# EAGLE design secs_q84 v2 (EAGLE 9.7.0)
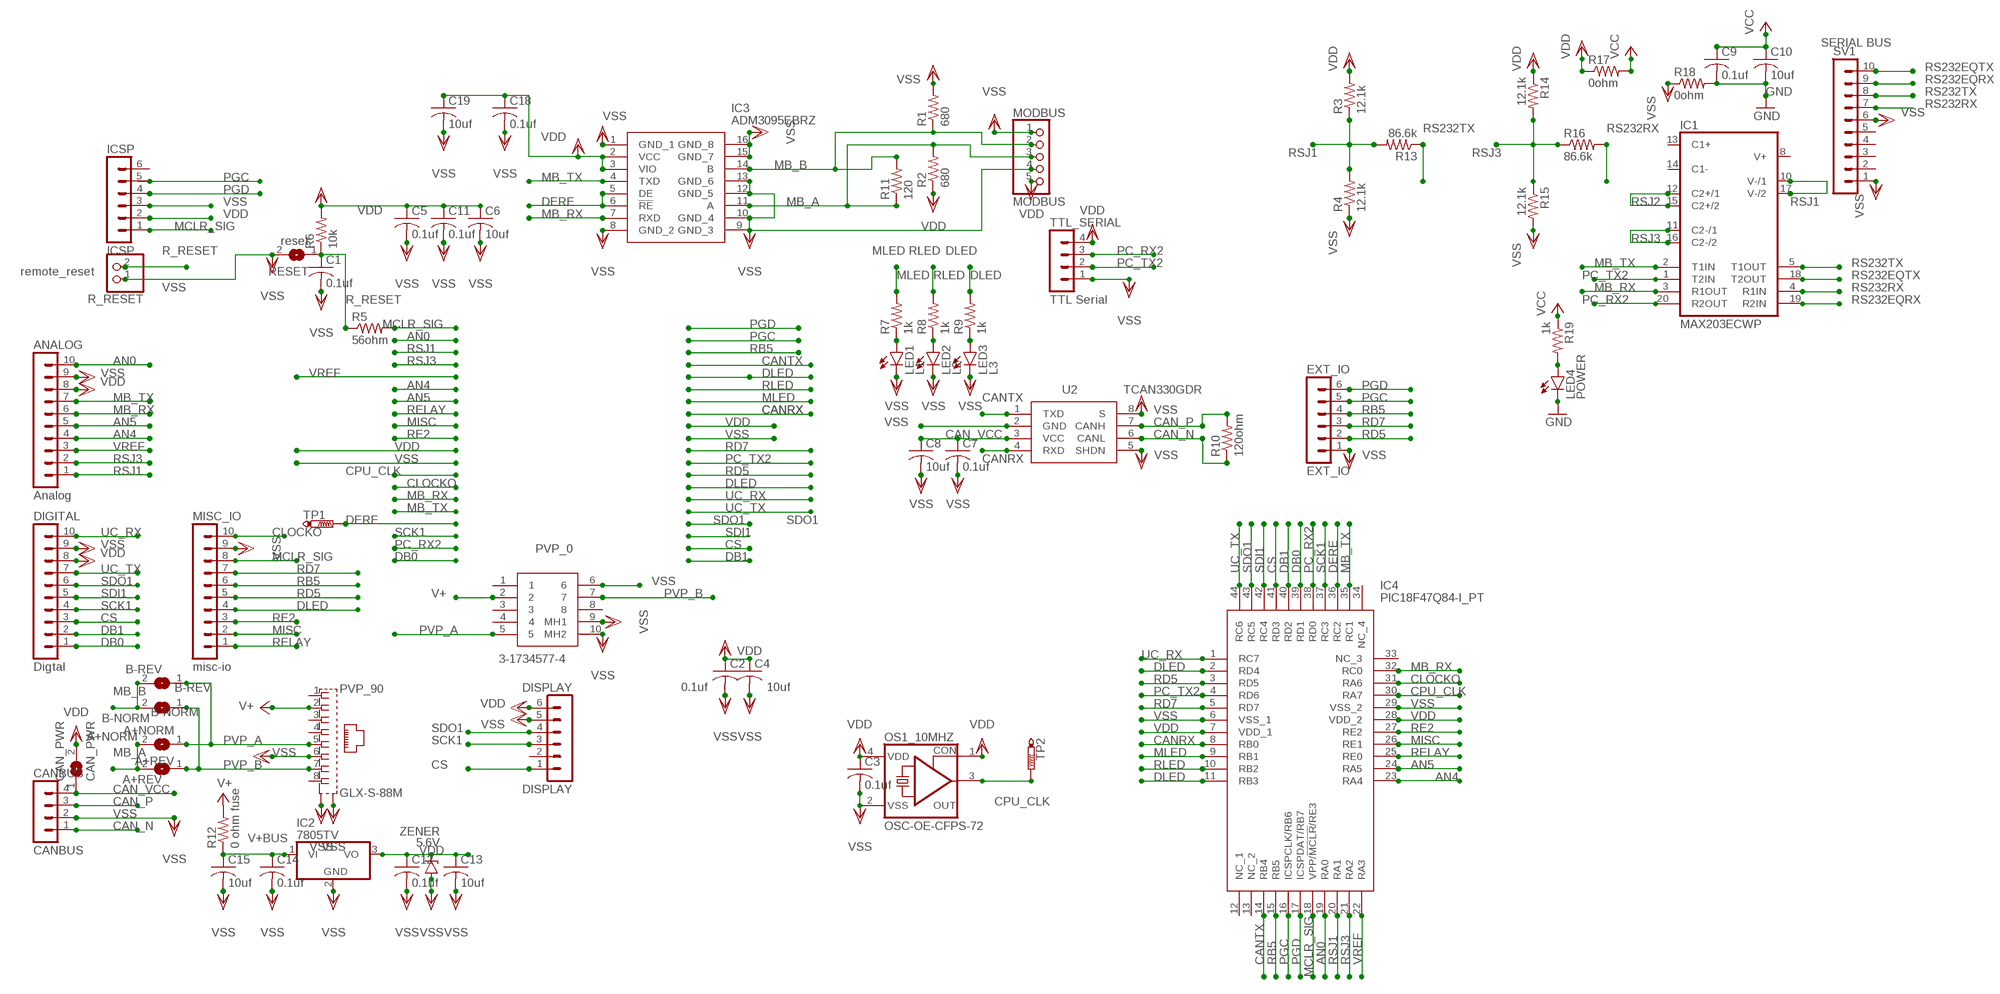
[diagram p0: schematic, sheet 1]

## Parts
A+NORM  A+NORM  SJ  [SJ]
A+REV  A+REV  SJ  [SJ]
ANALOG  Analog  MA10-1  [MA10-1]
B-NORM  B-NORM  SJ  [SJ]
B-REV  B-REV  SJ  [SJ]
C1  0.1uf  C-USC0805  [C0805]
C2  0.1uf  C-USC0805  [C0805]
C3  0.1uf  C-USC0805  [C0805]
C4  10uf  C-USC0805  [C0805]
C5  0.1uf  C-USC0805  [C0805]
C6  10uf  C-USC0805  [C0805]
C7  0.1uf  C-USC0805  [C0805]
C8  10uf  C-USC0805  [C0805]
C9  0.1uf  C-USC0805  [C0805]
C10  10uf  C-USC0805  [C0805]
C11  0.1uf  C-USC0805  [C0805]
C12  0.1uf  C-USC0805  [C0805]
C13  10uf  C-USC0805  [C0805]
C14  0.1uf  C-USC0805  [C0805]
C15  10uf  C-USC0805  [C0805]
C18  0.1uf  C-USC0805  [C0805]
C19  10uf  C-USC0805  [C0805]
CAN_PWR  CAN_PWR  SJ  [SJ]
CANBUS  CANBUS  MA04-1  [MA04-1]
DIGITAL  Digtal  MA10-1  [MA10-1]
DISPLAY  DISPLAY  MA06-1  [MA06-1]
EXT_IO  EXT_IO  MA06-1  [MA06-1]
IC1  MAX203ECWP  [SO20L]
IC2  7805TV  [TO220V]
IC3  ADM3095EBRZ  [SOIC127P600X175-16N]
IC4  PIC18F47Q84-I_PT  [QFP80P1200X1200X120-44N]
ICSP  ICSP  MA06-1  [MA06-1]
LED1  L1  LEDCHIPLED_0805  [CHIPLED_0805]
LED2  L2  LEDCHIPLED_0805  [CHIPLED_0805]
LED3  L3  LEDCHIPLED_0805  [CHIPLED_0805]
LED4  POWER  LEDCHIP-LED0603  [CHIP-LED0603]
MISC_IO  misc-io  MA10-1  [MA10-1]
MODBUS  MODBUS  PINHD-1X5  [1X05]
OS1_10MHZ  OSC-OE-CFPS-72  [7.2X5.2-4-PAD]
PVP_0  3-1734577-4  [317345774]
PVP_90  GLX-S-88M  [GLX-S-88M]
R1  680  R-US_R0805  [R0805]
R2  680  R-US_R0805  [R0805]
R3  12.1k  R-US_R0805  [R0805]
R4  12.1k  R-US_R0805  [R0805]
R5  56ohm  R-US_R0805  [R0805]
R6  10k  R-US_R0805  [R0805]
R7  1k  R-US_R0805  [R0805]
R8  1k  R-US_R0805  [R0805]
R9  1k  R-US_R0805  [R0805]
R10  120ohm  R-US_R0805  [R0805]
R11  120  R-US_R0805  [R0805]
R12  0 ohm fuse  R-US_R1206  [R1206]
R13  86.6k  R-US_R0805  [R0805]
R14  12.1k  R-US_R0805  [R0805]
R15  12.1k  R-US_R0805  [R0805]
R16  86.6k  R-US_R0805  [R0805]
R17  0ohm  R-US_R0805  [R0805]
R18  0ohm  R-US_R0805  [R0805]
R19  1k  R-US_R0805  [R0805]
R_RESET  remote_reset  PINHD-1X2  [1X02]
RESET  reset  SJ  [SJ]
SV1  SERIAL BUS  MA10-1  [MA10-1]
TP1  PTR1PAD1-13  [P1-13]
TP2  PTR1PAD1-13  [P1-13]
TTL_SERIAL  TTL Serial  MA04-1  [MA04-1]
U2  TCAN330GDR  [SOIC127P600X175-8N]
ZENER  5.6V  ZENER-DIODESMB  [SMB]

## Nets
AN0: ANALOG.10 IC4.19(RA0)
AN4: ANALOG.4 IC4.23(RA4)
AN5: ANALOG.5 IC4.24(RA5)
CAN_N: CANBUS.1 R10.1 U2.6(CANL)
CAN_P: CANBUS.3 R10.2 U2.7(CANH)
CAN_VCC [icurrent]: C7.1 C8.1 CAN_PWR.1 CANBUS.4 U2.3(VCC)
CANRX: IC4.8(RB0) U2.4(RXD)
CANTX: IC4.14(RB4) U2.1(TXD)
CLOCKO: IC4.31(RA6) MISC_IO.10
CPU_CLK: IC4.30(RA7) OS1_10MHZ.3(OUT) TP2.TP
CS: DIGITAL.3 DISPLAY.1 IC4.41(RD3)
DB0: DIGITAL.1 IC4.39(RD1)
DB1: DIGITAL.2 IC4.40(RD2)
DERE: IC3.5(DE) IC3.6(!RE) IC4.36(RC2) TP1.TP
DLED: IC4.2(RD4) IC4.11(RB3) MISC_IO.4 R9.2
GND [icurrent]: C9.2 C10.2 LED4.C R18.2
MB_A: A+NORM.2 A+REV.2 IC3.11(A) MODBUS.3 R2.2 R11.1
MB_B: B-NORM.2 B-REV.2 IC3.14(B) MODBUS.2 R1.1 R11.2
MB_RX: ANALOG.6 IC1.3(R1OUT) IC3.7(RXD) IC4.32(RC0)
MB_TX: ANALOG.7 IC1.2(T1IN) IC3.4(TXD) IC4.35(RC1)
MCLR_SIG: IC4.18(VPP/!MCLR!/RE3) ICSP.1 MISC_IO.8 R5.2
MISC: IC4.26(RE1) MISC_IO.2
MLED: IC4.9(RB1) R7.2
N$3: LED4.A R19.2
N$4: LED1.A R7.1
N$5: LED2.A R8.1
N$6: LED3.A R9.1
PC_RX2: IC1.20(R2OUT) IC4.38(RD0) TTL_SERIAL.3
PC_TX2: IC1.1(T2IN) IC4.4(RD6) TTL_SERIAL.2
PGC: EXT_IO.5 IC4.16(ICSPCLK/RB6) ICSP.5
PGD: EXT_IO.6 IC4.17(ICSPDAT/RB7) ICSP.4
PVP_A: A+NORM.1 B-REV.1 PVP_0.5 PVP_90.5
PVP_B: A+REV.1 B-NORM.1 PVP_0.7 PVP_90.7
R_RESET: C1.1 R5.1 R6.1 R_RESET.2 RESET.1
RB5: EXT_IO.4 IC4.15(RB5) MISC_IO.6
RD5: EXT_IO.2 IC4.3(RD5) MISC_IO.5
RD7: EXT_IO.3 IC4.5(RD7) MISC_IO.7
RE2: IC4.27(RE2) MISC_IO.3
RELAY: IC4.25(RE0) MISC_IO.1
RLED: IC4.10(RB2) R8.2
RS232EQRX: IC1.19(R2IN) SV1.9
RS232EQTX: IC1.18(T2OUT) SV1.10
RS232RX: IC1.4(R1IN) R16.2 SV1.7
RS232TX: IC1.5(T1OUT) R13.1 SV1.8
RSJ1: ANALOG.1 IC1.10(V-/1) IC1.17(V-/2) IC4.20(RA1) R3.1 R4.2 R13.2
RSJ2: IC1.12(C2+/1) IC1.15(C2+/2)
RSJ3: ANALOG.2 IC1.11(C2-/1) IC1.16(C2-/2) IC4.21(RA2) R14.2 R15.1 R16.1
SCK1: DIGITAL.4 DISPLAY.3 IC4.37(RC3)
SDI1: DIGITAL.5 IC4.42(RC4)
SDO1: DIGITAL.6 DISPLAY.4 IC4.43(RC5)
UC_RX: DIGITAL.10 IC4.1(RC7)
UC_TX: DIGITAL.7 IC4.44(RC6)
V+ [icurrent]: PVP_0.2 PVP_90.2 R12.2
V+BUS [icurrent]: C14.1 C15.1 IC2.1(VI) R12.1
VCC [icurrent]: C9.1 C10.1 R17.2 R19.1
VDD [icurrent]: ANALOG.8 C2.1 C3.1 C4.1 C5.1 C6.1 C11.1 C12.1 C13.1 C18.1 C19.1 CAN_PWR.2 DIGITAL.8 DISPLAY.6 IC2.3(VO) IC3.2(VCC) IC3.3(VIO) IC4.7(VDD_1) IC4.28(VDD_2) ICSP.2 MODBUS.5 OS1_10MHZ.1(CON) OS1_10MHZ.4(VDD) R2.1 R3.2 R6.2 R14.1 R17.1 TTL_SERIAL.4 ZENER.C
VREF: ANALOG.3 IC4.22(RA3)
VSS [icurrent]: ANALOG.9 C1.2 C2.2 C3.2 C4.2 C5.2 C6.2 C7.2 C8.2 C11.2 C12.2 C13.2 C14.2 C15.2 C18.2 C19.2 CANBUS.2 DIGITAL.9 DISPLAY.5 EXT_IO.1 IC2.2(GND) IC3.1(GND_1) IC3.8(GND_2) IC3.9(GND_3) IC3.10(GND_4) IC3.12(GND_5) IC3.13(GND_6) IC3.15(GND_7) IC3.16(GND_8) IC4.6(VSS_1) IC4.29(VSS_2) ICSP.3 LED1.C LED2.C LED3.C MISC_IO.9 MODBUS.1 MODBUS.4 OS1_10MHZ.2(VSS) PVP_0.6 PVP_0.9(MH1) PVP_0.10(MH2) PVP_90.6 PVP_90.S1 PVP_90.S2 R1.2 R4.1 R15.2 R18.1 R_RESET.1 RESET.2 SV1.1 SV1.6 TTL_SERIAL.1 U2.2(GND) U2.5(SHDN) U2.8(S) ZENER.A
Unconnected: DISPLAY.2 IC1.8(V+) IC1.13(C1+) IC1.14(C1-) IC4.12(NC_1) IC4.13(NC_2) IC4.33(NC_3) IC4.34(NC_4) ICSP.6 PVP_0.1 PVP_0.3 PVP_0.4 PVP_0.8 PVP_90.1 PVP_90.3 PVP_90.4 PVP_90.8 SV1.2 SV1.3 SV1.4 SV1.5

## Power pins joined to a net without a drawn wire
GND: IC1.6(GND) IC1.9(GND)
VCC: IC1.7(VCC)

## Library data of the parts
A+NORM A+REV B-NORM B-REV CAN_PWR RESET = jumper:SJ: SMD solder JUMPER
ANALOG DIGITAL MISC_IO SV1 = con-lstb:MA10-1: PIN HEADER; OC_FARNELL: unknown; OC_NEWARK: unknown
C1-C15 C18 C19 = rcl:C-US: CAPACITOR, American symbol; SPICEPREFIX: C
CANBUS TTL_SERIAL = con-lstb:MA04-1: PIN HEADER; OC_FARNELL: unknown; OC_NEWARK: unknown
DISPLAY EXT_IO ICSP = con-lstb:MA06-1: PIN HEADER; OC_FARNELL: unknown; OC_NEWARK: unknown
IC1 = maxim:MAX203ECWP: RS232 TRANSCEIVER; MPN: MAX203ECWP+G36; OC_FARNELL: 1224204; OC_NEWARK: 89K3435
IC2 = linear:78*: Positive VOLTAGE REGULATOR Source: http://cache.national.com/ds/LM/LM78L05.pdf http://www.fairchildsemi.com/ds/LM/LM7805.pdf
IC3 = ADM3095EBRZ:ADM3095EBRZ: Level 4 EMC Protected RS-485 Transceiver with Full +/-42 V Fault Protection Source: Datasheet <https://componentsearchengine.com/Datasheets/1/ADM3095EBRZ.pdf>; DESCRIPTION: Level 4 EMC Protected RS-485 Transceiver with Full +/-42 V Fault Protection; HEIGHT: 1.75mm; MANUFACTURER_NAME: Analog Devices; MANUFACTURER_PART_NUMBER: ADM3095EBRZ; MOUSER_PART_NUMBER: 584-ADM3095EBRZ; MOUSER_PRICE-STOCK: https://www.mouser.com/Search/Refine.aspx?Keyword=584-ADM3095EBRZ
IC4 = PIC18F47Q84-I_PT:PIC18F47Q84-I_PT: 8-bit Microcontrollers - MCU CAN-FD, 128KB Flash, 13KB RAM, 12b ADC3, UTMR, DAC, Comp, PWM, CCP, CWG, HLT, WWDT, SCAN/CRC, ZCD, PPS,Comms IDLE/DOZE/PMD, JTAG Source: Datasheet <https://ww1.microchip.com/downloads/en/DeviceDoc/PIC18F27-47-57Q84-Data-Sheet-40002213D.pdf>; DESCRIPTION: 8-bit Microcontrollers - MCU CAN-FD, 128KB Flash, 13KB RAM, 12b ADC3, UTMR, DAC, Comp, PWM, CCP, CWG, HLT, WWDT, SCAN/CRC, ZCD, PPS,Comms IDLE/DOZE/PMD, JTAG; HEIGHT: 1.2mm; MANUFACTURER_NAME: Microchip; MANUFACTURER_PART_NUMBER: PIC18F47Q84-I/PT; MOUSER_PART_NUMBER: 579-PIC18F47Q84-I/PT; MOUSER_PRICE-STOCK: https://www.mouser.co.uk/ProductDetail/Microchip-Technology/PIC18F47Q84-I-PT?qs=d0WKAl%252BL4KYthTnAmf%2FYSg%3D%3D
LED1-LED4 = led:LED: LED OSRAM: - CHIPLED LG R971, LG N971, LY N971, LG Q971, LY Q971, LO R971, LY R971 LH N974, LH R974 LS Q976, LO Q976, LY Q976 LO Q996 - Hyper CHIPLED LW Q18S LB Q993, LB Q99A, LB R99A - SideLED LS A670, LO A670, LY A670, LG A670, LP A670 LB A673, LV A673, LT A673, LW A673 LH A674 LY A675 LS A676, LA A676, LO A676, LY A676, LW A676 LS A679, LY A679, LG A679 - Hyper Micro SIDELED® LS Y876, LA Y876, LO Y876, LY Y876 LT Y87S - SmartLED LW L88C, LW L88S LB L89C, LB L89S, LG L890 LS L89K, LO L89K, LY L89K LS L896, LA L896, LO L896, LY L896 - TOPLED LS T670, LO T670, LY T670, LG T670, LP T670 LSG T670, LSP T670, LSY T670, LOP T670, LYG T670 LG T671, LOG T671, LSG T671 LB T673, LV T673, LT T673, LW T673 LH T674 LS T676, LA T676, LO T676, LY T676, LB T676, LH T676, LSB T676, LW T676 LB T67C, LV T67C, LT T67C, LS T67K, LO T67K, LY T67K, LW E67C LS E67B, LA E67B, LO E67B, LY E67B, LB E67C, LV E67C, LT E67C LW T67C LS T679, LY T679, LG T679 LS T770, LO T770, LY T770, LG T770, LP T770 LB T773, LV T773, LT T773, LW T773 LH T774 LS E675, LA E675, LY E675, LS T675 LS T776, LA T776, LO T776, LY T776, LB T776 LHGB T686 LT T68C, LB T68C - Hyper Mini TOPLED® LB M676 - Mini TOPLED Santana® LG M470 LS M47K, LO M47K, LY M47K Source: http://www.osram.convergy.de LUXEON: - LUMILED® LXK2-PW12-R00, LXK2-PW12-S00, LXK2-PW14-U00, LXK2-PW14-V00 LXK2-PM12-R00, LXK2-PM12-S00, LXK2-PM14-U00 LXK2-PE12-Q00, LXK2-PE12-R00, LXK2-PE12-S00, LXK2-PE14-T00, LXK2-PE14-U00 LXK2-PB12-K00, LXK2-PB12-L00, LXK2-PB12-M00, LXK2-PB14-N00, LXK2-PB14-P00, LXK2-PB14-Q00 LXK2-PR12-L00, LXK2-PR12-M00, LXK2-PR14-Q00, LXK2-PR14-R00 LXK2-PD12-Q00, LXK2-PD12-R00, LXK2-PD12-S00 LXK2-PH12-R00, LXK2-PH12-S00 LXK2-PL12-P00, LXK2-PL12-Q00, LXK2-PL12-R00 Source: www.luxeon.com KINGBRIGHT: KA-3528ASYC Source: www.kingbright.com
MODBUS = pinhead:PINHD-1X5: PIN HEADER
OS1_10MHZ = IQD-Frequency-Products:OSC-OE: OSCILLATOR WITH OE
PVP_0 = 3-1734577-4:3-1734577-4: RJ45 Connector, Single Port, 1 x 1, Standard Connector Contact Density, Jack, Shielded, Cat 3, Standard - Latch Down, 8 Position, Standard Profile Source: Datasheet <https://www.te.com/commerce/DocumentDelivery/DDEController?Action=showdoc&DocId=Customer Drawing1734577D1pdfEnglishENG_CD_1734577_D1.pdf3-1734577-4>; DESCRIPTION: RJ45 Connector, Single Port, 1 x 1, Standard Connector Contact Density, Jack, Shielded, Cat 3, Standard - Latch Down, 8 Position, Standard Profile; HEIGHT: 16.8mm; MANUFACTURER_NAME: TE Connectivity; MANUFACTURER_PART_NUMBER: 3-1734577-4; MOUSER_PART_NUMBER: 571-3-1734577-4; MOUSER_PRICE-STOCK: https://www.mouser.co.uk/ProductDetail/TE-Connectivity-AMP/3-1734577-4?qs=Z4JOKa0a9TUSCOA052xCCw%3D%3D
PVP_90 = con-kycon:GLX-S-88M: Mod. Jack, Right Angle, 8 posiotion, 8 contatcs RJ45 Source: GLX-S-88M.pdf; OC_FARNELL: unknown; OC_NEWARK: unknown
R1-R19 = rcl:R-US_: RESISTOR, American symbol; SPICEPREFIX: R
R_RESET = pinhead:PINHD-1X2: PIN HEADER
TP1 TP2 = testpad:PTR1: TEST PIN
U2 = TCAN330GDR:TCAN330GDR: 3.3-V CAN Transceivers with CAN FD (Flexible Data Rate) Source: Datasheet <http://www.ti.com/lit/gpn/TCAN330G>; DESCRIPTION: 3.3-V CAN Transceivers with CAN FD (Flexible Data Rate); HEIGHT: 1.75mm; MANUFACTURER_NAME: Texas Instruments; MANUFACTURER_PART_NUMBER: TCAN330GDR; MOUSER_PART_NUMBER: 595-TCAN330GDR; MOUSER_PRICE-STOCK: https://www.mouser.co.uk/ProductDetail/Texas-Instruments/TCAN330GDR?qs=9DwIlvx97adeWwzxdqwSPw%3D%3D
ZENER = diode:ZENER-DIODE: Z-Diode

## Net classes
1 icurrent: width 0.305 mm

## Board
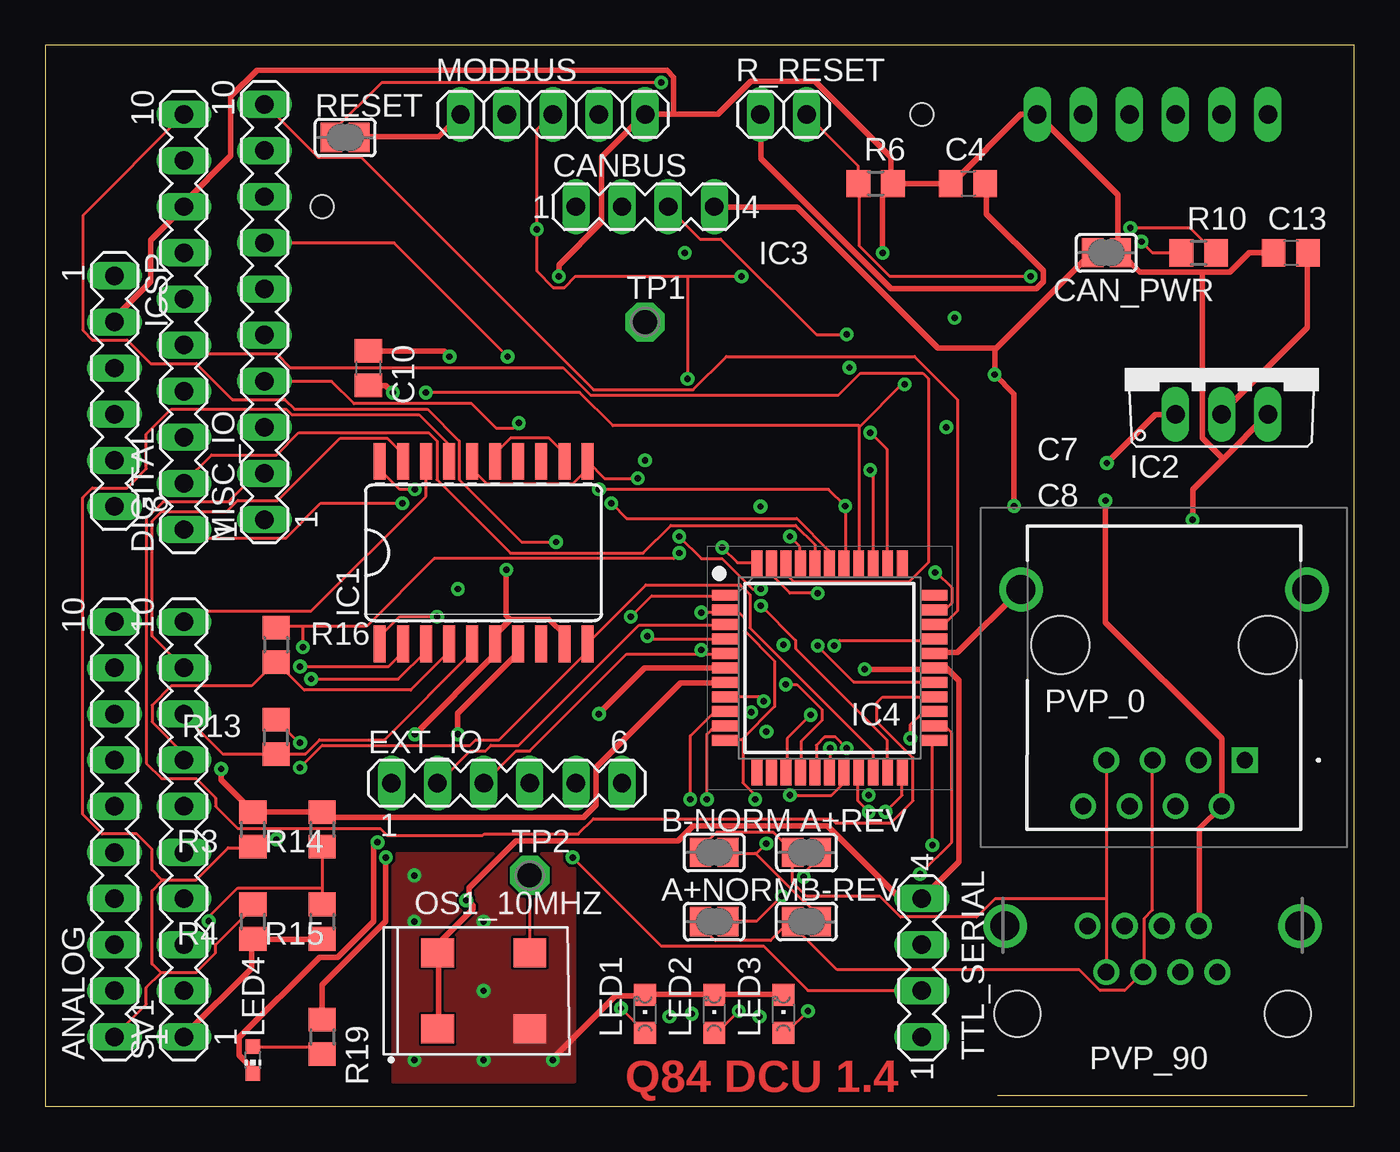
[diagram p1: board, top side]
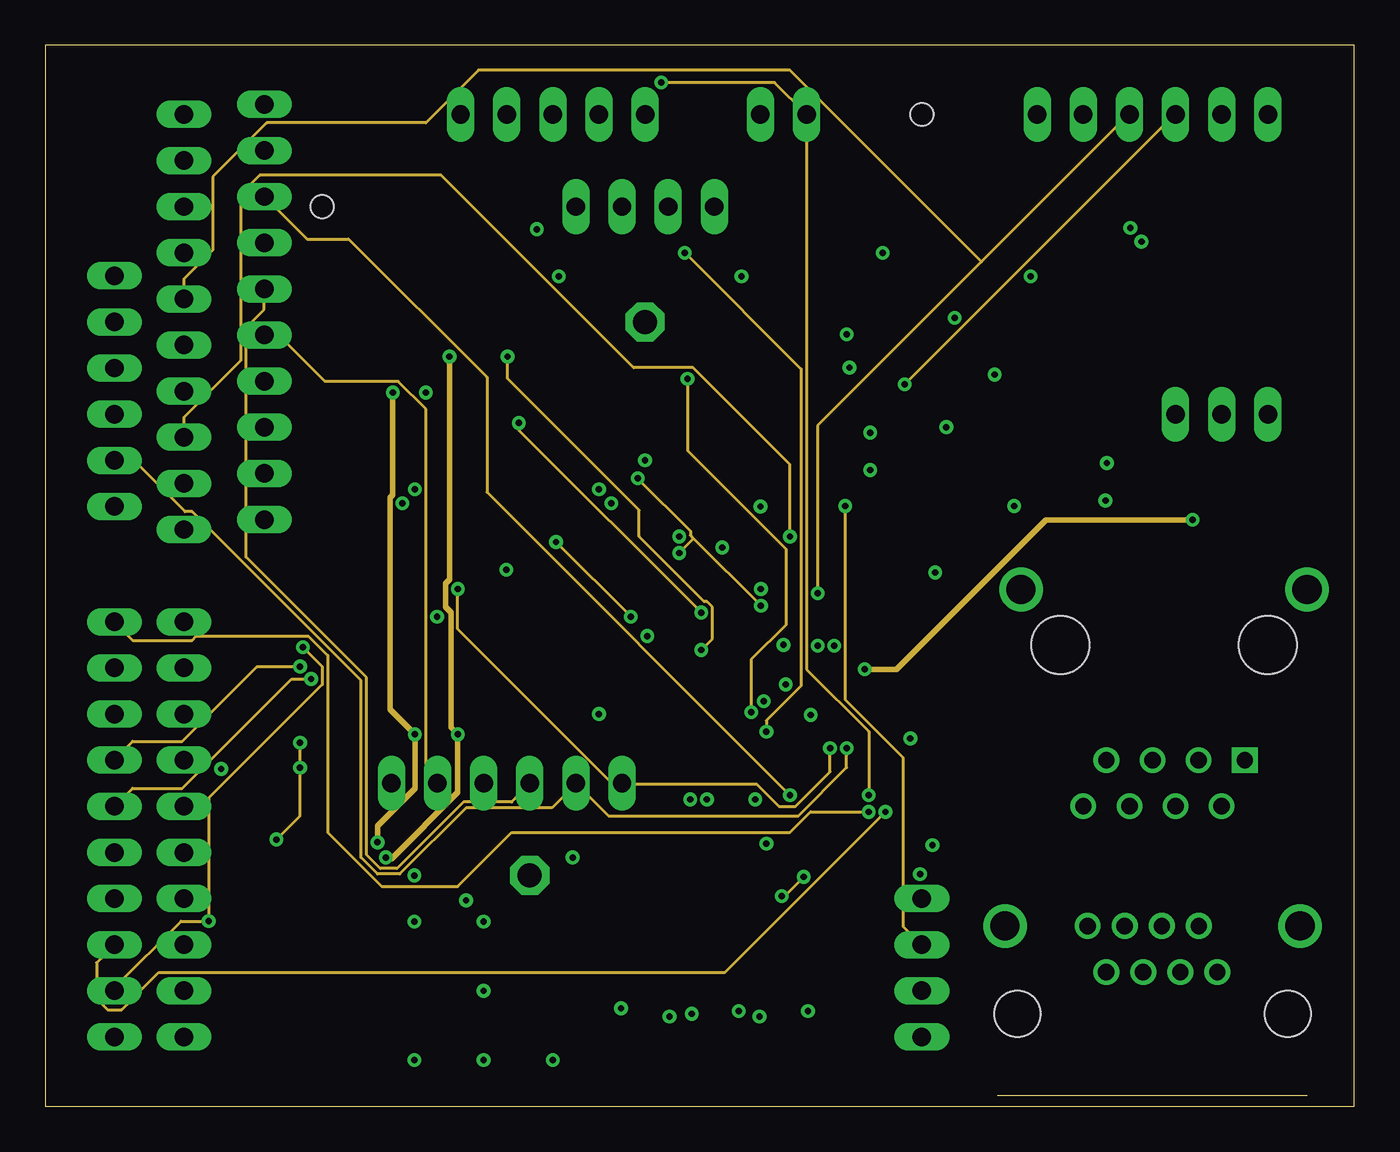
[diagram p2: board, inner layer Route2]
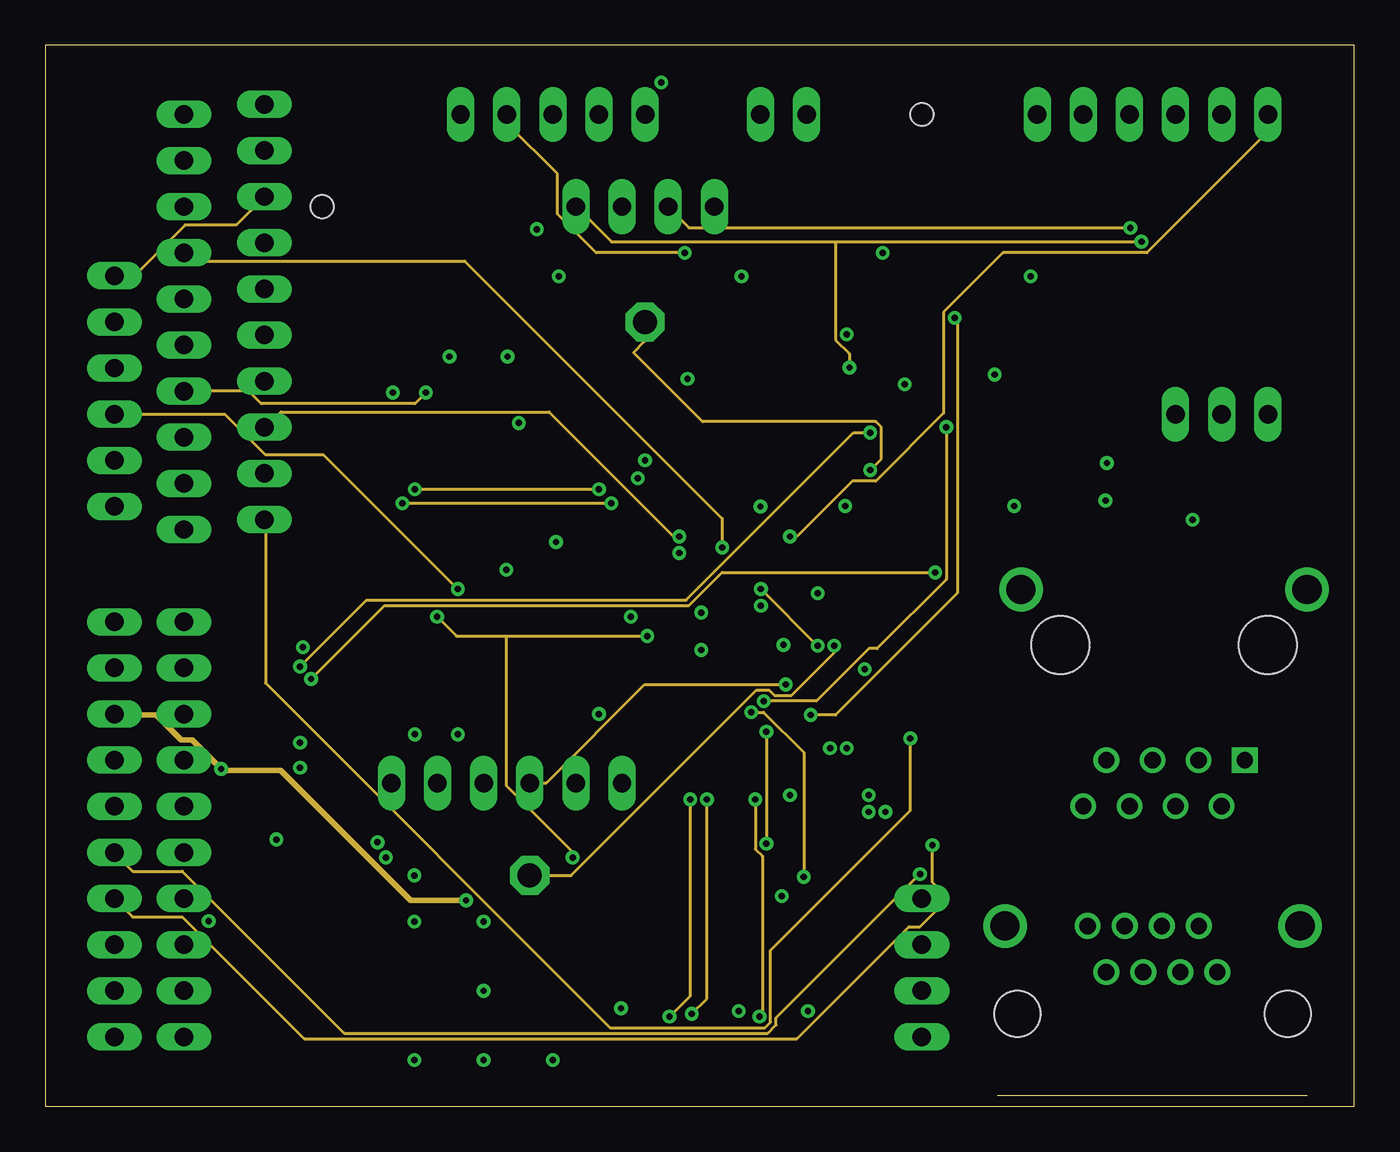
[diagram p3: board, inner layer Route15]
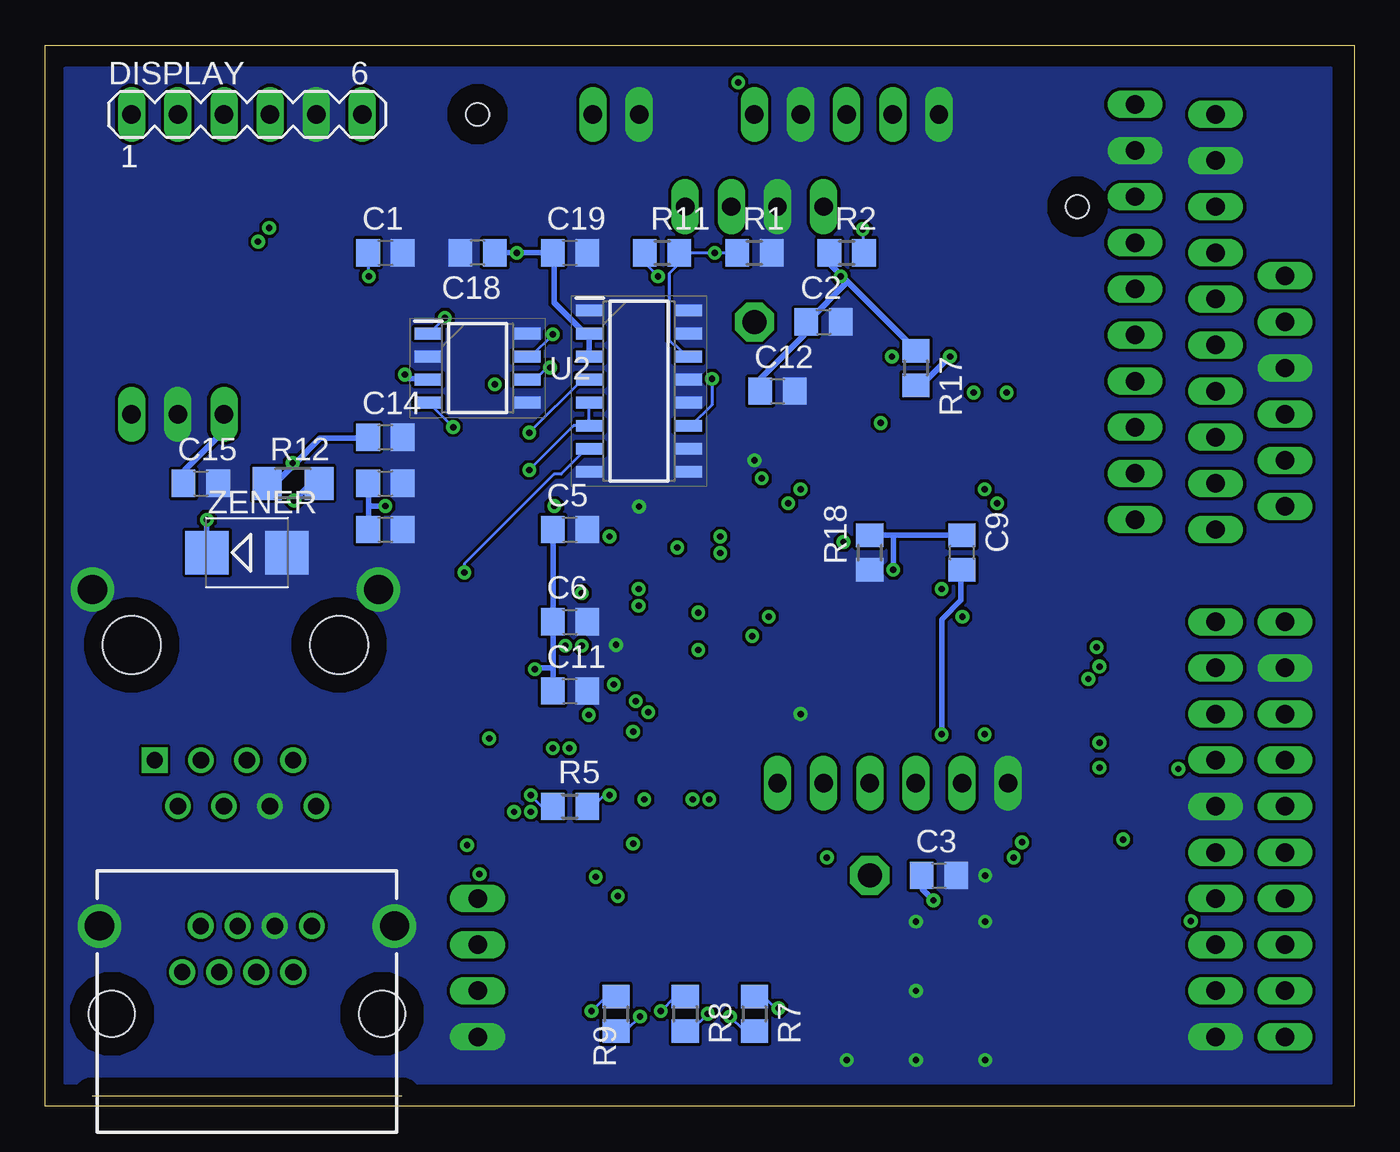
[diagram p4: board, bottom side, seen from below]

Size 72.06 x 58.41 mm. Coordinates in mm from the lower left corner, seen from the top.
Outline: 0,0 72.06,0 72.06,58.41 0,58.41 0,0
Copper layers (1+2*15+16): Top / Route2 / Route15 / Bottom
Stack-up 4 Layer Stack: Top SilkScreen Epoxy Ink / Top SolderMask SR:Green 0.0254mm Dk 4.3 / Top Surface Finish Lead-Free 0.02mm / Top CuFoil:007 0.035mm / Dielectric-1 Prepreg:001 0.064mm / Dielectric-2 Prepreg:001 0.064mm / Route2 CuFoil:007 0.035mm / Dielectric-3 Core:066 0.711mm / Route15 CuFoil:007 0.035mm / Dielectric-4 Prepreg:001 0.064mm / Dielectric-5 Prepreg:001 0.064mm / Bottom CuFoil:007 0.035mm / Bottom Surface Finish Lead-Free 0.02mm / Bottom SolderMask SR:Green 0.0254mm Dk 4.3 / Bottom SilkScreen Epoxy Ink
Design rules: minimum copper width class=1 12mil, minimum copper width 6mil, minimum drill size 0.35mm, copper clearance wire_polygon to wire_polygon 6mil, copper clearance wire_polygon to pad_smd 6mil, copper clearance wire_polygon to via 6mil, copper clearance pad_smd to pad_smd 6mil, copper clearance pad_smd to via 6mil, copper clearance via to via 6mil, copper clearance smd to pad (same net) 6mil, copper clearance smd to via (same net) 6mil, copper clearance smd to smd (same net) 6mil, dimension clearance 40mil, via restrict clearance 0mil, restrict clearance 0mil, drill distance 6mil, keepout clearance 0mil
Holes 1.27 mm at 48.26,54.61 15.24,49.53 13.97,-3.81 63.5,-3.81 63.5,-22.86 13.97,-22.86

### Footprints (pad centres in the part's own frame; a part is rotated, then mirrored left to right if it is on the bottom)
SJ = smd 1.168 x 1.6: 1 -0.762,0; 2 0.762,0
MA10-1 = drill 1.016 long: 1 -11.43,0; 2 -8.89,0; 3 -6.35,0; 4 -3.81,0; 5 -1.27,0; 6 1.27,0; 7 3.81,0; 8 6.35,0; 9 8.89,0; 10 11.43,0
C0805 = smd 1.3 x 1.5: 1 -0.95,0; 2 0.95,0
MA04-1 = drill 1.016 long: 1 -3.81,0; 2 -1.27,0; 3 1.27,0; 4 3.81,0
MA06-1 = drill 1.016 long: 1 -6.35,0; 2 -3.81,0; 3 -1.27,0; 4 1.27,0; 5 3.81,0; 6 6.35,0
SO20L = smd 0.66 x 2.032: 1 -5.715,-5.029; 2 -4.445,-5.029; 3 -3.175,-5.029; 4 -1.905,-5.029; 5 -0.635,-5.029; 6 0.635,-5.029; 7 1.905,-5.029; 8 3.175,-5.029; 9 4.445,-5.029; 10 5.715,-5.029; 11 5.715,5.029; 12 4.445,5.029; 13 3.175,5.029; 14 1.905,5.029; 15 0.635,5.029; 16 -0.635,5.029; 17 -1.905,5.029; 18 -3.175,5.029; 19 -4.445,5.029; 20 -5.715,5.029
TO220V = drill 1.016 long: 1 -2.54,-2.54; 2 0,-2.54; 3 2.54,-2.54
SOIC127P600X175-16N = smd 1.525 x 0.65: 1 -2.712,4.445; 2 -2.712,3.175; 3 -2.712,1.905; 4 -2.712,0.635; 5 -2.712,-0.635; 6 -2.712,-1.905; 7 -2.712,-3.175; 8 -2.712,-4.445; 9 2.712,-4.445; 10 2.712,-3.175; 11 2.712,-1.905; 12 2.712,-0.635; 13 2.712,0.635; 14 2.712,1.905; 15 2.712,3.175; 16 2.712,4.445
QFP80P1200X1200X120-44N = smd 1.475 x 0.6: 1 -5.738,4; 2 -5.738,3.2; 3 -5.738,2.4; 4 -5.738,1.6; 5 -5.738,0.8; 6 -5.738,0; 7 -5.738,-0.8; 8 -5.738,-1.6; 9 -5.738,-2.4; 10 -5.738,-3.2; 11 -5.738,-4; 23 5.738,-4; 24 5.738,-3.2; 25 5.738,-2.4; 26 5.738,-1.6; 27 5.738,-0.8; 28 5.738,0; 29 5.738,0.8; 30 5.738,1.6; 31 5.738,2.4; 32 5.738,3.2; 33 5.738,4 | smd 0.6 x 1.475: 12 -4,-5.738; 13 -3.2,-5.738; 14 -2.4,-5.738; 15 -1.6,-5.738; 16 -0.8,-5.738; 17 0,-5.738; 18 0.8,-5.738; 19 1.6,-5.738; 20 2.4,-5.738; 21 3.2,-5.738; 22 4,-5.738; 34 4,5.738; 35 3.2,5.738; 36 2.4,5.738; 37 1.6,5.738; 38 0.8,5.738; 39 0,5.738; 40 -0.8,5.738; 41 -1.6,5.738; 42 -2.4,5.738; 43 -3.2,5.738; 44 -4,5.738
CHIPLED_0805 = smd 1.2 x 1.2: A 0,-1.05; C 0,1.05
CHIP-LED0603 = smd 0.8 x 0.8: A 0,-0.75; C 0,0.75
1X05 = drill 1.016 long: 1 -5.08,0; 2 -2.54,0; 3 0,0; 4 2.54,0; 5 5.08,0
7.2X5.2-4-PAD = smd 1.8 x 1.6: 1 -2.54,-2.1; 2 2.54,-2.1; 3 2.54,2.1; 4 -2.54,2.1
317345774 = drill 0.9 pad 1.4 square: 1 0,0 | drill 0.9 pad 1.4: 2 -1.27,-2.54; 3 -2.54,0; 4 -3.81,-2.54; 5 -5.08,0; 6 -6.35,-2.54; 7 -7.62,0; 8 -8.89,-2.54 | drill 1.6 pad 2.4: 9 3.43,9.4; 10 -12.32,9.4 | hole 3.2: 1.27,6.35; -10.16,6.35
GLX-S-88M = drill 0.9 pad 1.422: 1 -3.57,-2.3; 2 -2.55,-4.84; 3 -1.53,-2.3; 4 -0.51,-4.84; 5 0.51,-2.3; 6 1.53,-4.84; 7 2.55,-2.3; 8 3.57,-4.84 | drill 1.6 pad 2.184: S1 -8.125,-4.84; S2 8.125,-4.84 | hole 2.55: -7.44,0; 7.44,0
R0805 = smd 1.3 x 1.5: 1 -0.95,0; 2 0.95,0
R1206 = smd 1.6 x 1.803: 1 -1.422,0; 2 1.422,0
1X02 = drill 1.016 long: 1 -1.27,0; 2 1.27,0
P1-13 = drill 1.321 pad 2.159 octagon: TP 0,0
SOIC127P600X175-8N = smd 1.528 x 0.65: 1 -2.711,1.905; 2 -2.711,0.635; 3 -2.711,-0.635; 4 -2.711,-1.905; 5 2.711,-1.905; 6 2.711,-0.635; 7 2.711,0.635; 8 2.711,1.905
SMB = smd 2.4 x 2.4: A 2.2,0; C -2.2,0

### Placement (x,y rotation side)
A+NORM  36.83,10.16 0 top
A+REV  41.91,13.97 0 top
ANALOG  3.81,15.24 90 top
B-NORM  36.83,13.97 0 top
B-REV  41.91,10.16 0 top
C1  53.34,46.99 0 bottom
C2  29.21,43.18 0 bottom
C3  22.86,12.7 0 bottom
C4  50.8,50.8 0 top
C5  43.18,31.75 0 bottom
C6  43.18,26.67 0 bottom
C7  53.34,34.29 0 bottom
C8  53.34,31.75 0 bottom
C9  21.59,30.48 90 bottom
C10  17.78,40.64 270 top
C11  43.18,22.86 0 bottom
C12  31.75,39.37 0 bottom
C13  68.58,46.99 0 top
C14  53.34,36.83 0 bottom
C15  63.5,34.29 0 bottom
C18  48.26,46.99 180 bottom
C19  43.18,46.99 0 bottom
CAN_PWR  58.42,46.99 0 top
CANBUS  33.02,49.53 0 top
DIGITAL  7.62,43.18 90 top
DISPLAY  60.96,54.61 0 bottom
EXT_IO  25.4,17.78 0 top
IC1  24.13,30.48 0 top
IC2  64.77,40.64 0 top
IC3  39.37,39.37 0 bottom
IC4  43.18,24.13 0 top
ICSP  3.81,39.37 270 top
LED1  33.02,5.08 0 top
LED2  36.83,5.08 0 top
LED3  40.64,5.08 0 top
LED4  11.43,2.54 180 top
MISC_IO  12.06,43.73 90 top
MODBUS  27.94,54.61 0 top
OS1_10MHZ  24.13,6.35 0 top
PVP_0  66.04,19.05 0 top
PVP_90  60.96,5.08 180 top
R1  33.02,46.99 0 bottom
R2  27.94,46.99 0 bottom
R3  11.43,15.24 90 top
R4  11.43,10.16 90 top
R5  43.18,16.51 0 bottom
R6  45.72,50.8 0 top
R7  33.02,5.08 270 bottom
R8  36.83,5.08 270 bottom
R9  40.64,5.08 270 bottom
R10  63.5,46.99 0 top
R11  38.1,46.99 0 bottom
R12  58.42,34.29 0 bottom
R13  12.7,20.32 90 top
R14  15.24,15.24 270 top
R15  15.24,10.16 270 top
R16  12.7,25.4 270 top
R17  24.13,40.64 270 bottom
R18  26.67,30.48 90 bottom
R19  15.24,3.81 270 top
R_RESET  40.64,54.61 0 top
RESET  16.51,53.34 0 top
SV1  7.62,15.24 90 top
TP1  33.02,43.18 0 top
TP2  26.67,12.7 0 top
TTL_SERIAL  48.26,7.62 90 top
U2  48.26,40.64 0 bottom
ZENER  60.96,30.48 0 bottom

### Tracks (layer width: path | path; a pad name or v marks a point on that pad's centre or on a via)
AN0  (via drill 0.35)
  Top 0.152: v45.34,16.21 44.73,16.82 44.73,18.34 IC4.19
  Route2 0.152: v45.34,16.21 42.14,16.21 41,15.06 25.68,15.06 22.71,12.09 18.52,12.09 15.54,15.06 15.54,24.82 14.48,25.88 8.31,25.88 8.08,25.65 4.8,25.65 3.81,26.64 ANALOG.10
AN4  (via drill 0.35)
  Top 0.152: v48.84,14.38 48.84,20.09 IC4.23
  Route15 0.152: v48.84,14.38 48.84,12.32 49.3,11.86 49.3,11.02 48.16,9.88 47.55,9.88 41.38,3.71 14.25,3.71 7.54,10.41 4.8,10.41 3.81,11.4 ANALOG.4
AN5  (via drill 0.35)
  Top 0.152: v48.16,12.78 49.91,14.53 49.91,20.55 49.53,20.93 IC4.24
  Route15 0.152: v48.16,12.78 40.23,4.85 40.23,4.47 39.78,4.01 16.46,4.01 7.54,12.93 4.8,12.93 3.81,13.92 ANALOG.5
CAN_N  (via drill 0.35)
  Top 0.152: R10.1 60.96,46.99 v60.35,47.6
  Route15 0.152: 43.51,47.6 31.17,47.6 29.26,49.5 CANBUS.1 | 43.51,47.6 v60.35,47.6 | v44.27,40.67 44.27,41.43 43.51,42.19 43.51,47.6
  Bottom 0.152: v44.27,40.67 44.42,40.67 45.03,40.06 45.49,40.06 U2.6
CAN_P  (via drill 0.35)
  Top 0.152: v59.74,48.36 63.02,48.36 64.39,46.99 R10.2 | v44.12,42.49 42.44,42.49 37.19,47.75 36.04,47.75 34.29,49.5 CANBUS.3
  Route15 0.152: v59.74,48.36 35.43,48.36 34.29,49.5 CANBUS.3
  Bottom 0.152: U2.7 45.34,41.28 v44.12,42.49
CAN_VCC  (via drill 0.35)
  Top 0.305: 52.27,41.66 v52.27,40.28 53.34,39.22 v53.34,33.05 | 52.27,41.66 57.61,46.99 CAN_PWR.1 | CANBUS.4 36.88,49.5 41.38,49.5 49.15,41.73 52.2,41.73 52.27,41.66
  Bottom 0.305: 54.25,33.05 54.25,34.27 C7.1 | 54.25,33.05 54.25,31.75 C8.1 | v52.27,40.28 52.05,40.06 50.98,40.06 U2.3 | v53.34,33.05 54.25,33.05
CANRX  (via drill 0.35)
  Top 0.152: v39.55,22.3 39.32,22.53 37.49,22.53 IC4.8
  Route15 0.152: v39.55,22.3 42.44,22.3 45.34,25.2 45.8,25.2 49.61,29.01 v49.61,37.39
  Bottom 0.152: v49.61,37.39 50.9,38.68 U2.4
CANTX  (via drill 0.35)
  Top 0.152: v42.14,21.54 40.84,20.24 40.84,18.42 IC4.14
  Route15 0.152: v42.14,21.54 43.51,21.54 50.22,28.25 50.22,43.26 v50.06,43.41
  Bottom 0.152: v50.06,43.41 50.9,42.57 U2.1
CLOCKO
  Top 0.152: IC4.31 48.92,26.57 49.53,26.57 50.22,27.25 50.22,38.91 47.85,41.28 37.49,41.28 35.66,39.45 30.18,39.45 17.37,52.25 15.01,52.25 12.12,55.14 MISC_IO.10
CPU_CLK  (via drill 0.35)
  Top 0.152: v43.43,25.35 43.74,25.65 48.84,25.65 IC4.30 | TP2.TP OS1_10MHZ.3
  Route15 0.152: v43.43,25.35 43.43,24.97 41.07,22.61 40.16,22.61 39.85,22.91 39.17,22.91 28.96,12.7 TP2.TP
CS  (via drill 0.35)
  Top 0.152: v41,31.37 41.53,30.84 41.53,29.92 IC4.41
  Route2 0.152: DIGITAL.3 7.62,37.92 10.74,41.05 10.74,50.19 11.81,51.26 21.79,51.26 32.38,40.67 35.66,40.67 41,35.33 v41,31.37
  Route15 0.152: v41,31.37 41.38,31.37 44.42,34.42 45.72,34.42 49.45,38.15 49.45,43.71 52.73,46.99 60.66,46.99 67.28,53.62 67.28,54.61 DISPLAY.1
DB0  (via drill 0.35)
  Top 0.152: v31.17,33.2 32,32.36 41.38,32.36 43.13,30.61 43.13,29.92 IC4.39 | v19.66,33.2 15.16,33.2 13.26,31.29 8.08,31.29 DIGITAL.1
  Route15 0.152: v19.66,33.2 v31.17,33.2
DB1
  Top 0.152: IC4.40 42.37,29.92 42.37,30.91 41.3,31.98 34.44,31.98 32.92,30.46 25.6,30.46 21.56,34.49 21.56,36.63 21.11,37.08 13.95,37.08 12.72,35.86 9.14,35.86 7.62,34.34 DIGITAL.2
DERE  (via drill 0.35)
  Top 0.152: v45.41,35.03 45.57,34.87 45.57,29.92 IC4.36
  Route15 0.152: v45.41,35.03 46.02,35.64 46.02,37.39 45.72,37.69 36.2,37.69 32.38,41.5 33,42.11 33,43.18 TP1.TP
  Bottom 0.152: v45.41,35.03 42.98,37.47 42.14,37.47 | 42.14,37.47 42.14,38.68 IC3.5 | 42.14,37.47 IC3.6
DLED  (via drill 0.35)
  Top 0.152: 38.37,20.21 40.16,22 40.16,24.51 38.48,26.19 38.48,26.87 38.1,27.25 37.49,27.25 IC4.2 37.49,27.18 v36.12,27.18 | 38.37,20.21 38.33,20.17 37.49,20.17 IC4.11 | v39.09,16.89 39.09,17.12 38.41,17.81 38.41,20.17 38.37,20.21 | v26.06,37.62 25.76,37.31 24.84,37.31 23.47,38.68 16.99,38.68 15.77,39.9 12.12,39.9 MISC_IO.4
  Route2 0.152: v26.06,37.62 26.06,37.24 v36.12,27.18
  Route15 0.152: v39.32,4.93 39.47,5.08 39.47,13.77 39.09,14.15 v39.09,16.89
  Bottom 0.152: v39.32,4.93 40.08,4.17 40.61,4.17 R9.2
GND  (via drill 0.35)
  Top 0.305: LED4.C 11.43,2.03 10.67,2.79 10.67,3.79 15.09,8.2 16.08,8.2 18.06,10.18 18.06,14.3 v18.29,14.53 | v20.34,20.47 24.77,24.89 IC1.6 24.84,25.58 24.84,26.04 25.6,26.8 | v19.13,39.29 18.75,39.67 17.83,39.67 C10.2 | IC1.9 28.57,25.96 27.74,26.8 25.6,26.8 | v25.38,29.54 25.38,27.03 25.6,26.8
  Route2 0.305: v18.29,14.53 18.29,15.44 20.34,17.5 v20.34,20.47 18.97,21.84 18.97,33.5 19.13,33.66 v19.13,39.29
  Bottom 0.305: 25.38,31.44 26.67,31.44 R18.2 | 25.38,31.44 21.64,31.44 C9.2 | v25.38,29.54 25.38,31.44
MB_A  (via drill 0.35)
  Top 0.152: v40.54,11.56 39.17,10.18 37.64,10.18 A+NORM.2 | v41.76,12.62 41.76,12.85 42.67,13.77 A+REV.2 | MODBUS.3 27.89,54.61 27.05,53.77 v27.05,48.28 27.05,46 27.96,45.08 28.57,45.08 29.18,45.69 35.36,45.69 | 35.36,45.69 v38.33,45.69 | 35.36,45.69 v35.36,40.06
  Route2 0.152: v40.54,11.56 40.69,11.56 v41.76,12.62 | v38.86,21.69 38.86,24.59 40.77,26.49 40.77,30.68 35.36,36.09 v35.36,40.06
  Route15 0.152: v41.76,12.62 41.76,19.48 39.55,21.69 v38.86,21.69
  Bottom 0.152: v27.05,48.28 27.05,46.99 R2.2 | v38.33,45.69 39.01,46.38 39.01,46.99 R11.1 | IC3.11 36.5,37.47 35.36,38.61 v35.36,40.06
MB_B  (via drill 0.35)
  Top 0.152: B-REV.2 42.67,10.41 41.83,11.25 41.76,11.25 39.13,13.88 | 39.13,13.88 39.09,13.92 37.64,13.92 B-NORM.2 | v39.7,14.45 39.13,13.88
  Route2 0.152: v39.7,20.63 39.7,21.23 41.61,23.14 41.61,40.59 v35.2,46.99
  Route15 0.152: v35.2,46.99 30.33,46.99 28.19,49.12 28.19,51.33 25.45,54.08 25.45,54.61 MODBUS.2 | v39.7,20.63 v39.7,14.45
  Bottom 0.152: R1.1 v35.2,46.99 R11.2 37.19,46.99 37.19,46.38 37.72,45.85 37.72,42.19 37.49,41.96 37.41,41.96 36.73,41.28 IC3.14
MB_RX  (via drill 0.35)
  Top 0.152: v49,29.39 49.07,29.39 49.91,28.55 49.91,27.71 49.53,27.33 IC4.32 | IC1.3 20.95,25.04 19.43,23.52 v14.63,23.52
  Route2 0.152: v14.63,23.52 13.56,23.52 7.54,17.5 4.8,17.5 ANALOG.6
  Route15 0.152: v49,29.39 37.26,29.39 35.43,27.56 18.67,27.56 v14.63,23.52
  Bottom 0.152: v49,29.39 49,29.85 44.04,34.8 43.66,34.8 42.29,36.17 42.14,36.17 IC3.7
MB_TX  (via drill 0.35)
  Top 0.152: v45.41,37.08 46.33,36.17 46.33,29.92 IC4.35 | v14.02,24.21 18.9,24.21 19.66,24.97 19.66,25.43 IC1.2
  Route2 0.152: v14.02,24.21 11.66,24.21 7.54,20.09 4.8,20.09 3.81,19.1 ANALOG.7
  Route15 0.152: v45.41,37.08 44.5,37.08 35.28,27.86 17.68,27.86 v14.02,24.21
  Bottom 0.152: v45.41,37.08 42.52,39.98 42.14,39.98 IC3.4
MCLR_SIG  (via drill 0.35)
  Top 0.152: v41,17.12 43.28,17.12 43.97,17.81 43.97,18.34 IC4.18
  Route2 0.152: v41,17.12 24.31,33.81 24.31,40.13 16.69,47.75 14.4,47.75 12.12,50.04 MISC_IO.8
  Route15 0.152: ICSP.1 3.81,45.77 4.95,45.77 7.7,48.51 10.52,48.51 12.04,50.04 MISC_IO.8
  Bottom 0.152: v41,17.12 41.3,17.12 41.91,16.51 R5.2
MISC
  Top 0.152: IC4.26 48.84,22.53 46.1,22.53 45.8,22.22 45.8,21.16 47.78,19.18 47.78,16.82 46.56,15.6 43.51,15.6 43.28,15.82 30.18,15.82 29.34,14.99 24.16,14.99 24.08,14.91 18.82,14.91 18.44,15.29 10.59,15.29 9.37,16.51 9.37,16.97 8.31,18.03 6.4,18.03 5.56,18.87 5.56,32.36 6.48,33.27 10.06,33.27 11.58,34.8 12.04,34.8 MISC_IO.2
MLED  (via drill 0.35)
  Top 0.152: v35.51,16.89 35.51,20.4 36.8,21.69 37.41,21.69 IC4.9
  Route15 0.152: v35.51,16.89 35.51,6.07 v34.37,4.93
  Bottom 0.152: v34.37,4.93 33.6,4.17 33.07,4.17 R7.2
N$3
  Top 0.152: LED4.A 11.43,3.25 14.86,3.25 R19.2
N$4  (via drill 0.35)
  Top 0.152: v31.7,5.39 33,4.09 LED1.A
  Bottom 0.152: v31.7,5.39 31.85,5.39 32.46,5.99 33,5.99 R7.1
N$5  (via drill 0.35)
  Top 0.152: v38.18,5.23 37.03,4.09 36.88,4.09 LED2.A
  Bottom 0.152: v38.18,5.23 37.41,5.99 36.88,5.99 R8.1
N$6  (via drill 0.35)
  Top 0.152: v41.99,5.23 40.84,4.09 40.69,4.09 LED3.A
  Bottom 0.152: v41.99,5.23 41.22,5.99 40.69,5.99 R9.1
PC_RX2  (via drill 0.35)
  Top 0.152: IC4.38 44.04,29.92 v44.04,33.05 43.13,33.96 v30.48,33.96 | v20.34,33.96 19.51,33.96 18.44,35.03 18.44,35.48 IC1.20
  Route2 0.152: v44.04,33.05 44.04,22.38 47.24,19.18 47.24,9.88 48.23,8.89 TTL_SERIAL.3
  Route15 0.152: v30.48,33.96 v20.34,33.96
PC_TX2  (via drill 0.35)
  Top 0.152: v33.15,25.88 33.3,25.73 37.41,25.73 IC4.4 | v21.56,26.95 19.51,26.95 18.44,25.88 18.44,25.5 IC1.1 | v29.03,13.69 33.91,8.81 39.55,8.81 41.99,6.38 48.23,6.38 TTL_SERIAL.2
  Route15 0.152: 25.38,25.88 22.63,25.88 v21.56,26.95 | 25.38,25.88 v33.15,25.88 | v29.03,13.69 29.03,14 25.38,17.65 25.38,25.88
PGC  (via drill 0.35)
  Top 0.152: v44.12,19.71 43.51,20.32 42.9,20.32 42.44,19.86 42.44,18.42 IC4.16
  Route2 0.152: v44.12,19.71 44.12,18.64 41.45,15.98 31.01,15.98 EXT_IO.5 29.18,17.73 27.89,16.43 23.16,16.43 19.51,12.78 18.29,12.78 17.37,13.69 17.37,23.44 8.08,32.74 7.7,32.74 4.88,35.56 ICSP.5
PGD  (via drill 0.35)
  Top 0.152: v43.2,19.71 43.2,18.42 IC4.17
  Route2 0.152: v43.2,19.71 43.2,18.42 41.3,16.51 40.39,16.51 39.17,17.73 31.77,17.73 EXT_IO.6 31.7,17.81 31.17,17.81 22.71,26.26 v22.71,28.47
  Route15 0.152: v22.71,28.47 15.32,35.86 12.12,35.86 9.91,38.08 3.81,38.08 ICSP.4
PVP_A
  Top 0.152: 41.15,10.11 40.92,10.11 39.93,9.12 36.88,9.12 36.12,9.88 36.12,10.11 A+NORM.1 | PVP_0.5 60.96,10.79 60.5,10.34 60.5,7.44 PVP_90.5 60.43,7.37 59.44,6.38 58.06,6.38 56.92,7.52 43.59,7.52 41.15,9.96 41.15,10.11 | 41.15,10.11 B-REV.1
PVP_B
  Top 0.152: B-NORM.1 36.12,14 36.12,14.22 36.96,15.06 40.08,15.06 41.15,14 A+REV.1 41.15,12.32 41.91,11.56 45.95,11.56 47.09,10.41 51.28,10.41 52.27,11.4 58.45,11.4 | 58.45,11.4 58.45,7.44 PVP_90.7 | 58.45,11.4 58.45,19.03 PVP_0.7
R_RESET  (via drill 0.35)
  Top 0.152: R_RESET.2 44.73,51.79 44.73,50.8 R6.1 44.81,50.8 44.81,47.37 46.48,45.69 v54.25,45.69 | v33.91,56.36 18.52,56.36 15.77,53.62 15.77,53.39 RESET.1
  Route2 0.152: v45.34,17.12 45.34,20.63 41.91,24.05 R_RESET.2 40.16,56.36 v33.91,56.36
  Bottom 0.152: R5.1 44.73,16.51 v45.34,17.12 | v54.25,45.69 54.25,46.99 C1.1
RB5  (via drill 0.35)
  Top 0.152: v40.77,23.22 41.38,23.22 42.75,21.84 42.75,21.23 41.61,20.09 41.61,18.42 IC4.15
  Route2 0.152: MISC_IO.6 12.04,44.93 12.04,43.87 11.05,42.88 11.05,30.23 17.68,23.6 17.68,13.84 18.44,13.08 19.36,13.08 23.01,16.74 25.68,16.74 26.67,17.73 EXT_IO.4
  Route15 0.152: v40.77,23.22 33,23.22 27.58,17.81 26.67,17.81 EXT_IO.4
RD5
  Top 0.152: IC4.3 37.41,26.49 32.69,26.49 26.06,19.86 24.54,19.86 24.23,19.56 23.39,19.56 21.64,17.81 EXT_IO.2
  Route2 0.152: EXT_IO.2 20.95,18.42 20.95,38.38 19.43,39.9 15.39,39.9 12.88,42.42 12.12,42.42 MISC_IO.5
RD7  (via drill 0.35)
  Top 0.152: 36.12,24.89 32,24.89 26.67,19.56 25.91,19.56 EXT_IO.3 | 36.12,24.89 37.41,24.89 IC4.5 | v25.45,41.28 19.2,47.52 12.12,47.52 MISC_IO.7 | 36.12,24.89 v36.12,25.12
  Route2 0.152: v25.45,41.28 25.45,40.06 32.69,32.82 32.69,31.37 36.27,27.79 36.42,27.79 36.73,27.48 36.73,25.73 v36.12,25.12
RE2  (via drill 0.35)
  Top 0.152: v42.52,25.35 44.5,23.37 48.84,23.37 IC4.27 | v39.39,28.47 38.94,28.47 37.26,30.15 36.12,30.15 v34.9,31.37
  Route15 0.152: v39.39,28.47 v42.52,25.35 | v34.9,31.37 34.59,31.37 27.74,38.23 12.95,38.23 12.12,37.39 MISC_IO.3
RELAY  (via drill 0.35)
  Top 0.152: v47.62,20.24 47.62,21.01 48.31,21.69 48.84,21.69 IC4.25
  Route15 0.152: v47.62,20.24 47.62,16.28 39.93,8.59 39.93,4.62 39.62,4.32 31.09,4.32 12.12,23.29 12.12,32.28 MISC_IO.1
RLED  (via drill 0.35)
  Top 0.152: v36.42,16.89 36.42,20.47 36.88,20.93 37.41,20.93 IC4.10
  Route15 0.152: v36.42,16.89 36.42,5.92 v35.59,5.08
  Bottom 0.152: v35.59,5.08 36.5,4.17 36.8,4.17 R8.2
RS232EQRX
  Top 0.152: SV1.9 5.87,25.88 5.87,32.21 6.4,32.74 9.98,32.74 10.59,33.35 12.8,33.35 16.23,36.78 18.82,36.78 19.66,35.94 19.66,35.56 IC1.19
RS232EQTX
  Top 0.152: IC1.18 20.95,33.58 14.63,27.25 8.15,27.25 7.62,26.72 SV1.10
RS232RX
  Top 0.152: IC1.4 22.17,25.43 22.17,24.97 20.12,22.91 14.25,22.91 12.72,24.43 R16.2 12.65,24.43 11.35,23.14 6.93,23.14 5.87,22.07 5.87,21.16 7.62,19.41 SV1.7
RS232TX
  Top 0.152: SV1.8 7.62,21.54 9.75,19.41 12.65,19.41 R13.1 12.72,19.41 14.33,19.41 15.09,20.17 18.67,20.17 23.47,24.97 23.47,25.43 IC1.5
RSJ1  (via drill 0.35)
  Top 0.152: IC4.20 45.57,18.42 45.57,19.56 38.79,26.34 38.79,28.17 38.25,28.7 33.07,28.7 29.87,25.5 IC1.10 29.79,25.43 29.79,24.97 24.99,20.17 23.7,20.17 23.39,19.86 15.24,19.86 v14.02,18.64 | R4.2 11.43,10.95 9.37,8.89 9.37,8.43 8.31,7.37 6.4,7.37 6.36,7.33 | 6.36,7.33 5.56,6.53 5.56,5.61 3.81,3.86 ANALOG.1 | 6.44,12.43 5.87,11.86 5.87,7.82 6.36,7.33 | 6.44,12.43 6.48,12.47 8.31,12.47 10.06,14.22 11.43,14.22 R3.1 11.81,14.68 v12.72,14.68 | v14.02,20.01 13.95,20.01 12.72,21.23 R13.2 | 6.44,12.43 5.87,13 5.87,14.15 5.03,14.99 3.12,14.99 2.06,16.05 2.06,33.5 2.59,34.04 4.5,34.04 5.56,35.1 5.56,37.01 6.93,38.38 13.26,38.38 13.56,38.08 20.57,38.08 22.17,36.47 22.17,35.56 IC1.17
  Route2 0.152: v14.02,20.01 v14.02,18.64 14.02,15.98 v12.72,14.68
RSJ2
  Top 0.152: IC1.15 24.77,35.94 25.6,36.78 27.74,36.78 28.57,35.94 IC1.12
RSJ3  (via drill 0.35)
  Top 0.152: R14.2 15.24,12.01 | 15.24,12.01 R15.1 | 15.24,12.01 10.59,12.01 8.99,10.41 v8.99,10.18 | v39.39,27.56 41.3,25.65 41.3,25.2 46.33,20.17 46.33,18.42 IC4.21 | v32.61,34.57 30.79,34.57 IC1.11 30.02,35.25 29.03,34.27 24.31,34.27 23.55,35.03 23.55,35.48 IC1.16 | 14.17,26.42 17.68,26.42 21.41,30.15 34.59,30.15 v34.9,30.46 | 14.17,26.42 12.72,26.42 R16.1 | 14.17,26.42 v14.17,25.27
  Route2 0.152: ANALOG.2 3.81,6.53 7.47,10.18 v8.99,10.18 8.99,16.97 15.24,23.22 15.24,24.21 v14.17,25.27 | 35.7,31.25 35.51,31.44 35.51,31.67 v32.61,34.57 | 35.7,31.25 v39.39,27.56 | 35.7,31.25 v34.9,30.46
SCK1  (via drill 0.35)
  Top 0.152: 44.84,37.43 47.17,39.75 v47.32,39.75 | 44.84,37.43 44.81,37.39 44.81,29.92 IC4.37 | v20.95,39.29 29.41,39.29 31.24,37.47 44.81,37.47 44.84,37.43
  Route2 0.152: v47.32,39.75 62.18,54.61 DISPLAY.3
  Route15 0.152: DIGITAL.4 11.2,39.37 11.89,38.68 20.34,38.68 v20.95,39.29
SDI1
  Top 0.152: IC4.42 40.84,29.85 40.84,29.24 41.22,28.85 47.55,28.85 48.62,29.92 48.62,40.06 48.31,40.36 44.88,40.36 43.66,39.14 30.02,39.14 28.5,40.67 13.49,40.67 12.72,41.43 8.08,41.43 7.62,41.89 DIGITAL.5
SDO1  (via drill 0.35)
  Top 0.152: v42.52,28.25 41,28.25 40,29.24 40,29.85 IC4.43
  Route2 0.152: v42.52,28.25 42.52,37.47 51.55,46.49 | 51.55,46.49 59.66,54.61 DISPLAY.4 | DIGITAL.6 7.62,45.54 9.22,47.14 9.22,51.18 12.19,54.15 20.95,54.15 23.85,57.05 41,57.05 51.55,46.49
UC_RX  (via drill 0.35)
  Top 0.152: v32.23,26.95 33.38,28.09 37.41,28.09 IC4.1 | v28.12,31.06 26.21,31.06 22.78,34.49 22.78,36.63 21.03,38.38 13.72,38.38 13.18,38.91 10.29,38.91 8.31,40.89 5.79,40.89 4.5,42.19 2.59,42.19 2.06,42.72 2.06,49.05 DIGITAL.10
  Route2 0.152: v28.12,31.06 v32.23,26.95
UC_TX  (via drill 0.35)
  Top 0.152: v37.26,30.76 38.1,29.92 39.17,29.92 IC4.44
  Route15 0.152: v37.26,30.76 37.26,32.36 23.09,46.53 8.08,46.53 DIGITAL.7
V+  (via drill 0.35)
  Top 0.305: v58.37,33.35 58.37,26.64 64.77,20.24 PVP_0.2 63.55,15.29 63.55,9.96 PVP_90.2
  Bottom 0.305: v58.37,33.35 57.45,34.27 57.07,34.27 R12.2
V+BUS  (via drill 0.35)
  Top 0.305: v58.45,35.41 61.11,38.08 62.18,38.08 IC2.1
  Bottom 0.305: C15.1 64.39,34.34 64.39,35.03 62.26,37.16 62.26,38.08 IC2.1 | 58.37,35.33 59.36,34.34 59.82,34.34 R12.1 | 58.37,35.33 56.92,36.78 54.33,36.78 C14.1 | v58.45,35.41 58.37,35.33
VCC  (via drill 0.35)
  Top 0.305: v22.25,41.28 21.95,41.58 17.83,41.58 C10.1 | R19.1 15.24,6.68 18.75,10.18 v18.75,13.69 | v22.71,20.47 22.71,21.61 25.98,24.89 25.98,25.43 IC1.7
  Route2 0.305: v18.75,13.69 18.82,13.61 19.05,13.61 22.71,17.27 v22.71,20.47 22.33,20.85 22.33,27.18 22.02,27.48 22.02,28.78 22.25,29.01 v22.25,41.28
  Bottom 0.305: v22.25,41.28 23.77,39.75 24.08,39.75 R17.2 | v22.71,20.47 22.71,26.8 21.64,27.86 21.64,29.46 C9.1
VDD  (via drill 0.35)
  Top 0.305: IC4.7 37.41,23.29 34.98,23.29 30.33,18.64 30.33,16.59 29.64,15.9 15.47,15.9 15.24,16.13 R14.1 15.16,16.21 11.43,16.21 R3.2 11.35,16.28 9.68,17.96 v9.68,18.57 | OS1_10MHZ.1 21.64,4.32 21.64,8.36 OS1_10MHZ.4 21.64,8.51 21.64,8.97 23.55,10.87 23.55,11.02 23.24,11.33 v23.16,11.33 23.32,11.4 23.32,12.01 25.91,14.61 34.82,14.61 35.66,15.44 43.05,15.44 47.02,11.48 48.16,11.48 TTL_SERIAL.4 50.29,13.46 50.29,23.44 49.61,24.13 IC4.28 48.84,24.05 v45.11,24.05 | v63.17,32.28 63.17,33.96 64.85,35.64 | IC2.3 64.85,35.64 | ICSP.2 3.81,43.41 5.79,45.39 5.79,47.68 7.62,49.5 DIGITAL.8 7.7,49.66 7.7,49.81 10.21,52.32 10.21,55.6 11.66,57.05 34.21,57.05 34.59,56.67 34.59,54.61 | C13.1 66.29,46.99 65.23,45.92 63.7,45.92 | 63.7,45.92 60.27,45.92 59.21,46.99 CAN_PWR.2 59.05,47.07 59.05,50.19 54.71,54.53 DISPLAY.6 53.72,54.61 49.99,50.88 C4.1 R6.2 | 34.59,54.61 37.03,54.61 38.86,56.44 42.37,56.44 46.56,52.25 46.56,50.88 R6.2 | 34.59,54.61 MODBUS.5 32.92,54.53 30.63,52.25 30.63,48.67 28.27,46.3 v28.27,45.69 | v46.1,46.99 46.1,50.11 46.63,50.65 R6.2 | 64.85,35.64 63.7,36.78 63.7,45.92
  Route2 0.305: v45.11,24.05 46.86,24.05 55.09,32.28 v63.17,32.28
  Route15 0.305: ANALOG.8 3.81,21.54 6.1,21.54 7.47,20.17 8.08,20.17 v9.68,18.57 9.75,18.49 12.95,18.49 20.12,11.33 v23.16,11.33
  Bottom 0.305: v23.16,11.33 23.77,11.94 23.77,12.7 C3.1 | 44.12,24.13 44.12,26.64 C6.1 44.12,26.8 C5.1 | 44.12,24.13 44.12,22.91 C11.1 | 44.12,24.13 45.03,24.13 v45.11,24.05 | 28.23,45.73 28.88,46.38 R2.1 | 28.23,45.73 27.89,45.39 | 27.89,45.39 24.16,41.66 R17.1 | 27.89,45.39 30.1,43.18 C2.1 30.25,43.1 30.25,42.49 32.69,40.06 C12.1 | v63.17,32.28 63.17,30.53 ZENER.C | IC3.3 42.14,41.28 42.14,42.49 IC3.2 42.29,42.49 44.04,44.25 44.04,46.91 C19.1 v46.1,46.99 C18.1 | v28.27,45.69 28.23,45.73
VREF  (via drill 0.35)
  Top 0.152: v46.25,16.21 47.17,17.12 47.17,18.34 IC4.22
  Route2 0.152: v46.25,16.21 37.41,7.37 6.25,7.37 4.19,5.31 3.43,5.31 2.82,5.92 2.82,7.9 ANALOG.3
VSS  (via drill 0.35)
  Top 0.305: LED3.C 40.61,6.15 36.96,6.15 LED2.C 36.8,6.15 33.07,6.15 LED1.C 32.92,6.07 31.39,6.07 27.89,2.57 v27.94,2.54 | R15.2 15.24,9.2 11.43,9.2 R4.1 11.35,9.12 11.35,7.59 7.62,3.86 SV1.1 | IC4.6 33,24.13 30.48,21.61 v30.48,21.59 | IC4.29 48.92,24.97 50.22,24.97 53.65,28.4 PVP_0.10 | C13.2 69.49,46.99 69.49,42.88 64.77,38.15 IC2.2 | C4.2 51.82,50.8 51.82,49.12 54.94,46 54.94,45.39 54.56,45.01 46.56,45.01 39.39,52.17 39.39,54.61 R_RESET.1 | MODBUS.1 21.64,53.39 17.3,53.39 RESET.2
  other vias: 39.37,33.02 33.02,35.56 40.64,25.4 24.13,10.16 24.13,6.35 24.13,2.54 20.32,12.7 20.32,2.54 20.32,10.16
  pour Bottom (rank 6, no thermals): 71.2,57.23 1.24,57.23 1.19,57.18 1.19,1.19 71.2,1.19
  pour Top (no thermals): 19.05,13.97 29.21,13.97 29.21,1.27 19.05,1.27

### Text on the board
Top: Q84 DCU 1.4